# EAGLE design camera board (EAGLE 9.5.0)
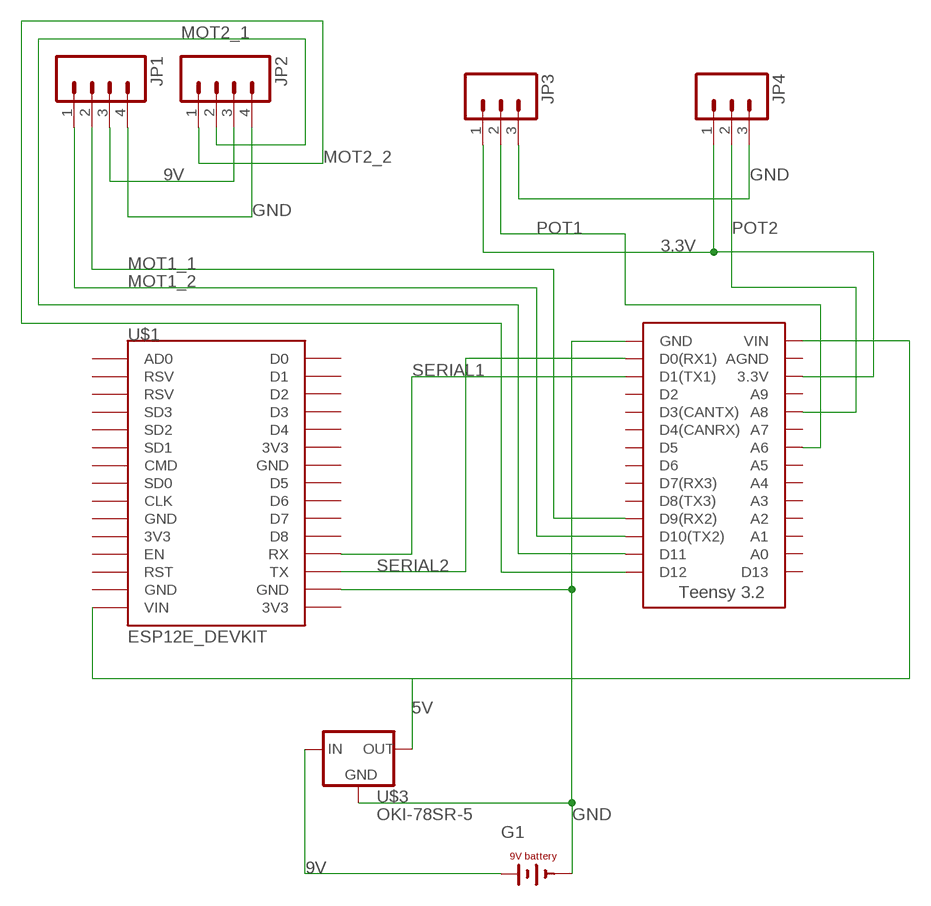
[diagram p0: schematic, sheet 1]

## Parts
G1  BAT9V  [AB9V]
JP1  M04  [1X04]
JP2  M04  [1X04]
JP3  M03  [1X03]
JP4  M03  [1X03]
U$1  ESP12E_DEVKIT  [ESP12E_DEVKIT]
U$2  TEENSY_3.2_SIMPLE  [TEENSY_3.2_SIMPLE]
U$3  OKI-78SR-5  [OKI-78SR]

## Nets
3.3V: JP3.1 JP4.1 U$2.3.3V
5V: U$1.VIN U$2.VIN U$3.3(OUT)
9V: G1.-(+) JP1.3 JP2.3 U$3.1(IN)
GND: G1.+(-) JP1.4 JP2.4 JP3.3 JP4.3 U$1.GND@3(GND) U$2.GND U$3.2(GND)
MOT1_1: JP1.2 U$2.D9(RX2)
MOT1_2: JP1.1 U$2.D10(TX2)
MOT2_1: JP2.2 U$2.D11
MOT2_2: JP2.1 U$2.D12
POT1: JP3.2 U$2.A6
POT2: JP4.2 U$2.A8
SERIAL1: U$1.RX U$2.D1(TX1)
SERIAL2: U$1.TX U$2.D0(RX1)
Unconnected: U$1.3V3@0(3V3) U$1.3V3@1(3V3) U$1.3V3@2(3V3) U$1.AD0 U$1.CLK U$1.CMD U$1.D0 U$1.D1 U$1.D2 U$1.D3 U$1.D4 U$1.D5 U$1.D6 U$1.D7 U$1.D8 U$1.EN U$1.GND@0(GND) U$1.GND@1(GND) U$1.GND@2(GND) U$1.RST U$1.RSV@0(RSV) U$1.RSV@1(RSV) U$1.SD0 U$1.SD1 U$1.SD2 U$1.SD3 U$2.A0 U$2.A1 U$2.A2 U$2.A3 U$2.A4 U$2.A5 U$2.A7 U$2.A9 U$2.AGND U$2.D2 U$2.D3(CANTX) U$2.D4(CANRX) U$2.D5 U$2.D6 U$2.D7(RX3) U$2.D8(TX3) U$2.D13

## Library data of the parts
G1 = tango:BAT9V: 9-V BATTERY CLIP
JP1 JP2 = HyTechDevices:M04: Standard 4-pin 0.1" header. NOTES ON THE VARIANTS LOCK and LOCK_LONGPADS... This footprint was designed to help hold the alignment of a through-hole component (i.e. 6-pin header) while soldering it into place. You may notice that each hole has been shifted either up or down by 0.005 of an inch from it's more standard position (which is a perfectly straight line). This slight alteration caused the pins (the squares in the middle) to touch the edges of the holes. Because they are alternating, it causes a "brace" to hold the component in place. 0.005 has proven to be the perfect amount of "off-center" position when using our standard breakaway headers. Although looks a little odd when you look at the bare footprint, once you have a header in there, the alteration is very hard to notice. Also,if you push a header all the way into place, it is covered up entirely on the bottom side. This idea of altering the position of holes to aid alignment will be further integrated into the Sparkfun Library for other footprints. It can help hold any component with 3 or more connection pins. Note: The Sparkfun version includes many other packages including surface mount that may be of future interest. Source: Sparkfun <https://github.com/sparkfun/SparkFun-Eagle-Libraries>
JP3 JP4 = HyTechDevices:M03: Standard 3-pin 0.1" header.
U$1 = ESP12E_DEVKIT:ESP12E_DEVKIT: ESP12E DEVKIT BOARD
U$2 = HyTechDevices:TEENSY_3.2_SIMPLE: Simple version of the Teensy 3.2 board that only uses the 2 main rows of pins, not the inner pins or the pins opposite the usb port.
U$3 = HyTechDevices:OKI-78SR-5: Murata OKI-78SR 5V 1.5A Non-Isolated Switching Regulator DC/DC - Datasheet <https://power.murata.com/data/power/oki-78sr.pdf>

## Board
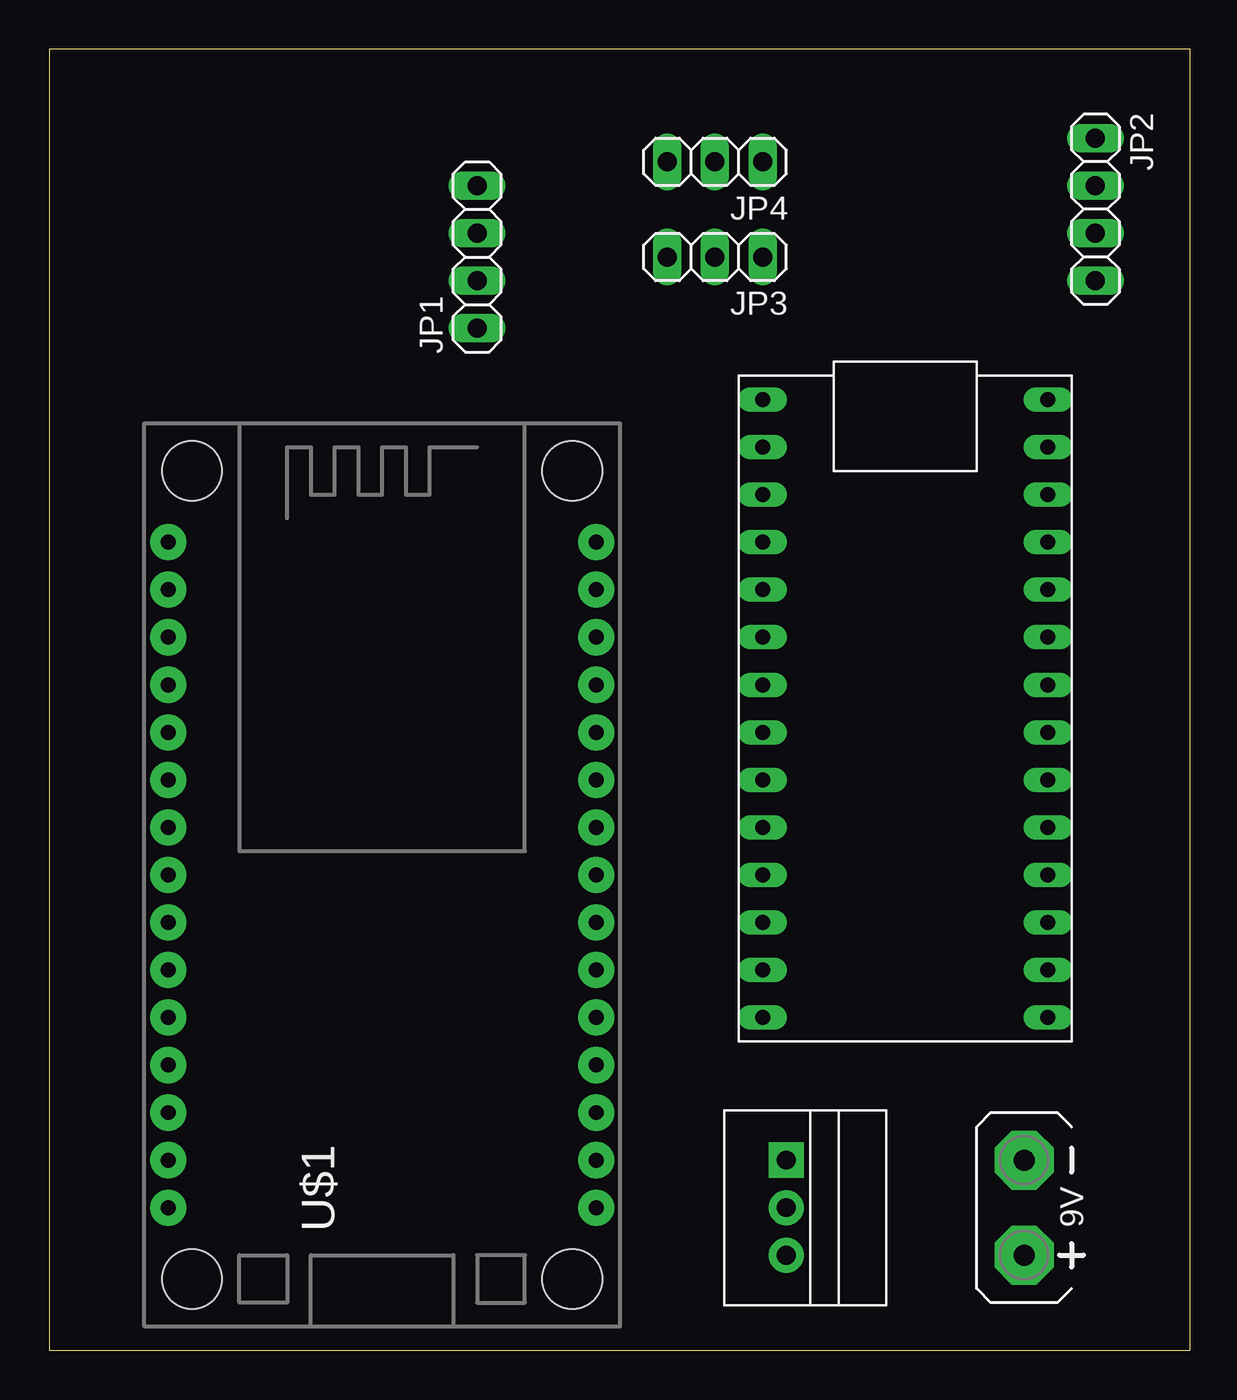
[diagram p1: board, top side]
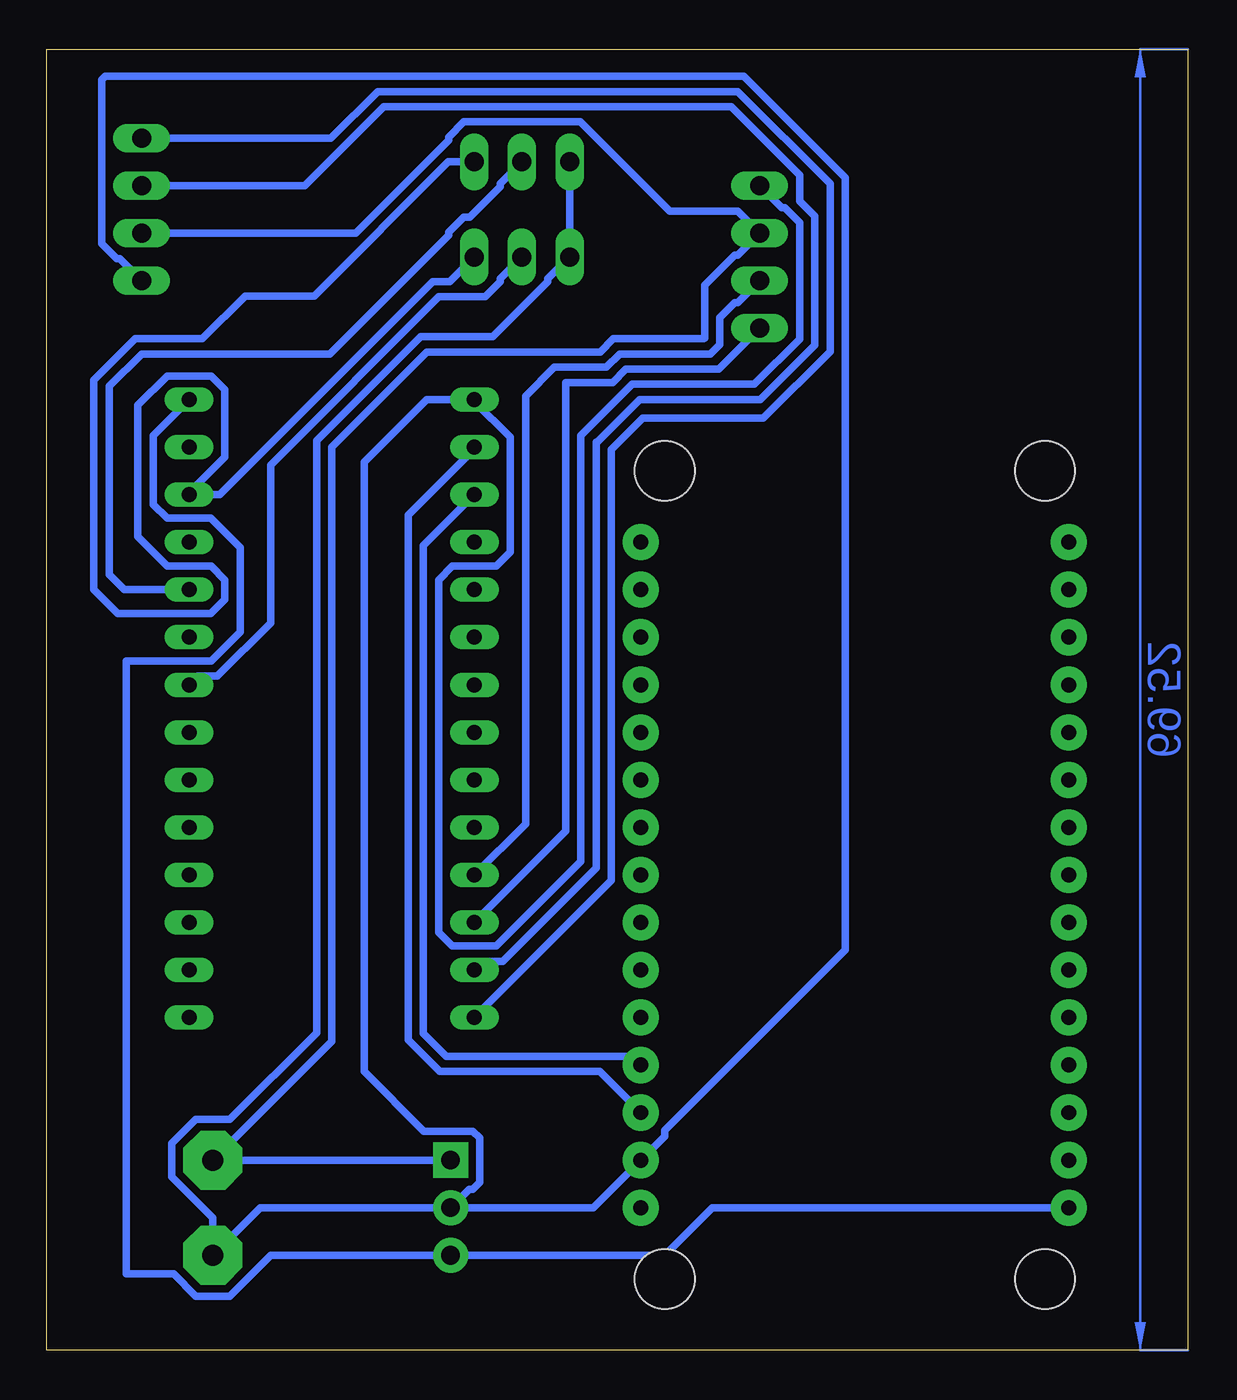
[diagram p2: board, bottom side, seen from below]

Size 60.94 x 69.52 mm. Coordinates in mm from the lower left corner, seen from the top.
Outline: 0,0 60.94,0 60.94,69.52 0,69.52 0,0
Copper layers (1*16): Top 0.035mm / dielectric 1.5mm / Bottom 0.035mm
Design rules "default *": minimum track width 6mil, minimum drill 0.35mm, track to track 16mil, track to pad 16mil, pad to pad 16mil, via to via 16mil, smd to smd 16mil, copper to edge 40mil, drill to drill 6mil, minimum pad ring 10mil, minimum via ring 8mil, stop-mask expansion 4mil, vias tented up to drill 0mil, thermal gap 10mil

### Footprints (pad centres in the part's own frame; a part is rotated, then mirrored left to right if it is on the bottom)
AB9V = drill 1.118 pad 3.15 octagon: + 0,2.54; - 0,-2.54
1X04 = drill 1.016 long: 1 -3.81,0; 2 -1.27,0; 3 1.27,0; 4 3.81,0
1X03 = drill 1.016 long: 1 -2.54,0; 2 0,0; 3 2.54,0
ESP12E_DEVKIT = drill 0.8 pad 1.93: 3V3@0 -11.43,-7.62; 3V3@1 11.43,5.08; 3V3@2 11.43,-17.78; AD0 -11.43,17.78; CLK -11.43,-2.54; CMD -11.43,2.54; D0 11.43,17.78; D1 11.43,15.24; D2 11.43,12.7; D3 11.43,10.16; D4 11.43,7.62; D5 11.43,0; D6 11.43,-2.54; D7 11.43,-5.08; D8 11.43,-7.62; EN -11.43,-10.16; GND@0 -11.43,-5.08; GND@1 -11.43,-15.24; GND@2 11.43,2.54; GND@3 11.43,-15.24; RST -11.43,-12.7; RSV@0 -11.43,15.24; RSV@1 -11.43,12.7; RX 11.43,-10.16; SD0 -11.43,0; SD1 -11.43,5.08; SD2 -11.43,7.62; SD3 -11.43,10.16; TX 11.43,-12.7; VIN -11.43,-17.78 | hole 3.2: -10.16,21.59; 10.16,21.59; 10.16,-21.59; -10.16,-21.59
TEENSY_3.2_SIMPLE = drill 0.8 long: 3.3V 16.51,29.21; A0 16.51,3.81; A1 16.51,6.35; A2 16.51,8.89; A3 16.51,11.43; A4 16.51,13.97; A5 16.51,16.51; A6 16.51,19.05; A7 16.51,21.59; A8 16.51,24.13; A9 16.51,26.67; AGND 16.51,31.75; D0(RX1) 1.27,31.75; D1(TX1) 1.27,29.21; D2 1.27,26.67; D3(CANTX) 1.27,24.13; D4(CANRX) 1.27,21.59; D5 1.27,19.05; D6 1.27,16.51; D7(RX3) 1.27,13.97; D8(TX3) 1.27,11.43; D9(RX2) 1.27,8.89; D10(TX2) 1.27,6.35; D11 1.27,3.81; D12 1.27,1.27; D13 16.51,1.27; GND 1.27,34.29; VIN 16.51,34.29
OKI-78SR = drill 1 pad 1.88 square: 1 -2.54,0 | drill 1 pad 1.88: 2 0,0; 3 2.54,0

### Placement (x,y rotation side)
G1  52.07,7.62 180 top
JP1  22.86,58.42 90 top
JP2  55.88,60.96 270 top
JP3  35.56,58.42 180 top
JP4  35.56,63.5 180 top
U$1  17.78,25.4 0 top
U$2  36.83,16.51 0 top
U$3  39.37,7.62 270 top

### Tracks (layer width: path | path; a pad name or v marks a point on that pad's centre or on a via)
3.3V
  Bottom 0.406: 53.34,45.62 U$2.3.3V | JP4.1 39.49,63.5 46.65,56.34 50.34,56.34 52.63,54.05 56.22,54.05 58.42,51.85 58.42,40.64 57.14,39.36 52.18,39.36 51.42,40.12 51.42,41.16 52.16,41.9 54.51,41.9 56.07,43.47 56.07,50.51 54.52,52.06 52.16,52.06 51.42,51.32 51.42,47.74 53.34,45.82 U$2.3.3V | JP3.1 39.42,57.1 40.33,57.1 51.71,45.72 U$2.3.3V
5V
  Bottom 0.406: U$2.VIN 55.26,48.88 55.26,45.2 54.52,44.46 52.18,44.46 50.61,42.89 50.61,38.39 52.16,36.84 56.69,36.84 56.69,4.07 54.15,4.07 52.98,2.9 51.16,2.9 48.98,5.08 U$3.3 27.94,5.08 25.4,7.62 U$1.VIN
9V
  Bottom 0.406: U$3.1 G1.- 45.72,16.51 45.72,48.26 40.64,53.34 31.39,53.34 30.68,54.05 25.84,54.05 25.81,54.08 25.81,56.91 24.19,58.52 24.03,58.52 JP1.3 24.03,60.86 27.68,60.86 32.45,65.63 38.67,65.63 39.47,64.83 39.47,64.67 44.45,59.69 JP2.3
GND
  Bottom 0.406: U$3.2 49.53,7.62 G1.+ 52.07,7.07 54.25,9.25 54.25,11.07 52.98,12.34 51.16,12.34 46.53,16.97 46.53,48.6 40.98,54.15 37.12,54.15 34.19,57.09 34.19,57.25 JP3.3 JP4.3 | U$3.2 31.75,7.62 U$1.GND@3 27.94,11.43 27.94,11.74 18.29,21.39 18.29,62.66 23.7,68.07 57.82,68.07 58.01,67.88 58.01,59.12 57.21,58.32 57.05,58.32 JP2.4 | U$3.2 38.38,8.61 38.18,8.61 37.82,8.97 37.82,11.35 38.18,11.71 40.8,11.71 43.99,14.9 43.99,47.45 40.64,50.8 U$2.GND 38.1,50.7 36.18,48.78 36.18,42.66 36.94,41.9 39.28,41.9 40.02,41.16 40.02,22.34 39.28,21.6 36.92,21.6 32.41,26.11 32.41,48.87 29.67,51.61 23.16,51.61 20.73,54.04 20.73,60.26 21.53,61.06 21.69,61.06 JP1.4 24.13,62.23
MOT1_1
  Bottom 0.406: U$2.D9(RX2) 35.37,28.13 35.37,50.99 33.83,52.53 31.05,52.53 30.34,53.24 25.5,53.24 24.99,53.75 24.99,55.18 24.19,55.98 24.03,55.98 JP1.2
MOT1_2
  Bottom 0.406: U$2.D10(TX2) 33.22,27.74 33.22,51.71 30.72,51.71 30,52.43 25.04,52.43 JP1.1
MOT2_1
  Bottom 0.406: U$2.D11 37.64,20.78 36.59,20.78 31.6,25.77 31.6,48.47 | 31.6,48.53 31.6,48.47 | 31.6,48.47 29.27,50.8 22.82,50.8 19.91,53.7 19.91,60.59 20.73,61.41 20.73,62.8 24.38,66.45 42.93,66.45 47.15,62.23 JP2.2
MOT2_2
  Bottom 0.406: U$2.D12 30.79,25.1 30.79,48.13 29.11,49.81 22.66,49.81 19.1,53.37 19.1,62.32 24.04,67.26 43.27,67.26 45.76,64.77 JP2.1
POT1
  Bottom 0.406: U$2.A6 52.88,36.02 51.83,36.02 48.98,38.87 48.98,47.3 39.99,56.29 37.53,56.29 36.73,57.09 36.73,57.25 JP3.2
POT2
  Bottom 0.406: JP4.2 36.73,62.33 36.73,62.17 38.34,60.55 38.67,60.55 39.47,59.75 39.47,59.59 45.82,53.24 55.88,53.24 57.61,51.51 57.61,41.45 56.79,40.64 U$2.A8
SERIAL1
  Bottom 0.406: U$1.RX 29.67,15.7 39.61,15.7 40.83,16.92 40.83,42.99 40.64,43.18 U$2.D1(TX1)
SERIAL2
  Bottom 0.406: U$1.TX 31.4,14.89 39.95,14.89 41.64,16.58 41.64,44.62 38.1,48.16 U$2.D0(RX1)
(copper drawn outside any net)
  shapes: Bottom area x1